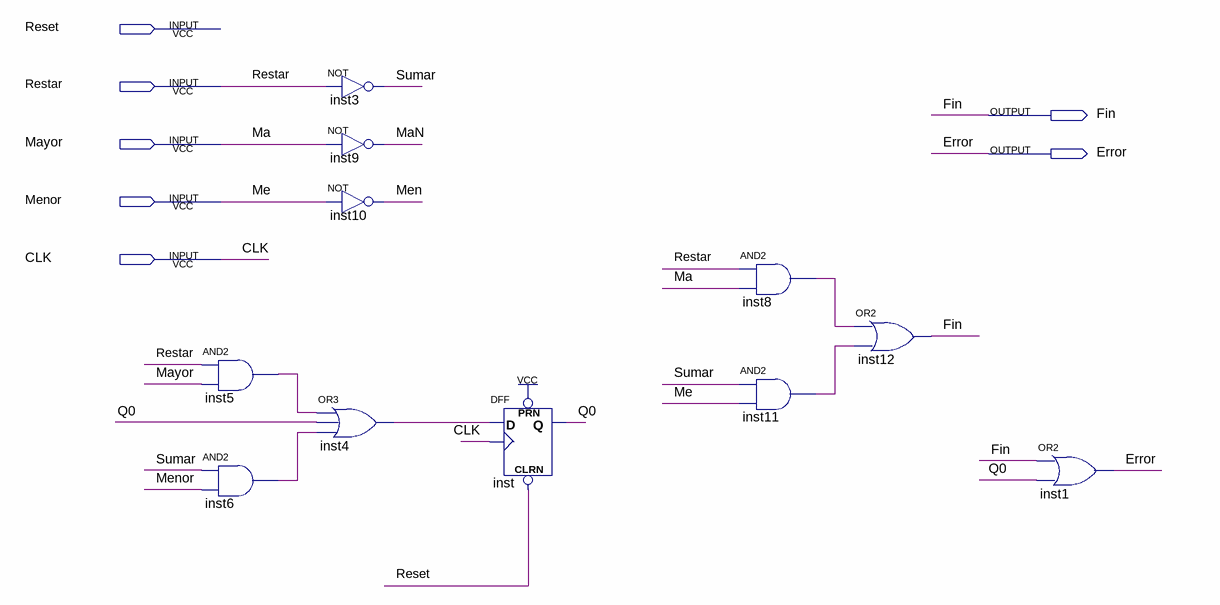
[diagram p0: schematic sheet]
// Quartus schematic AnalizadorCorte.bdf as structural Verilog: 11 symbols, 7 pins
module AnalizadorCorte (
  input  Reset,
  input  Restar,
  input  Mayor,
  input  Menor,
  input  CLK,
  output Fin,
  output Error
);

  wire inst4_out, inst5_out, inst6_out, inst8_out, inst11_out, MaN, Men, Q0, Sumar;

  and inst5 (inst5_out, Restar, Mayor);
  and inst6 (inst6_out, Sumar, Menor);
  not inst3 (Sumar, Restar);
  not inst9 (MaN, Mayor);
  not inst10 (Men, Menor);
  or inst4 (inst4_out, inst5_out, Q0, inst6_out);
  DFF inst (.CLRN(Reset), .CLK(CLK), .D(inst4_out), .PRN(1'b1), .Q(Q0));
  and inst8 (inst8_out, Restar, Mayor);
  and inst11 (inst11_out, Sumar, Menor);
  or inst12 (Fin, inst8_out, inst11_out);
  or inst1 (Error, Fin, Q0);

  // Other names for the same wires on the sheet: Ma = Mayor; Me = Menor
endmodule
